# EAGLE design mpp_bldc_GAN (EAGLE 9.2.2)
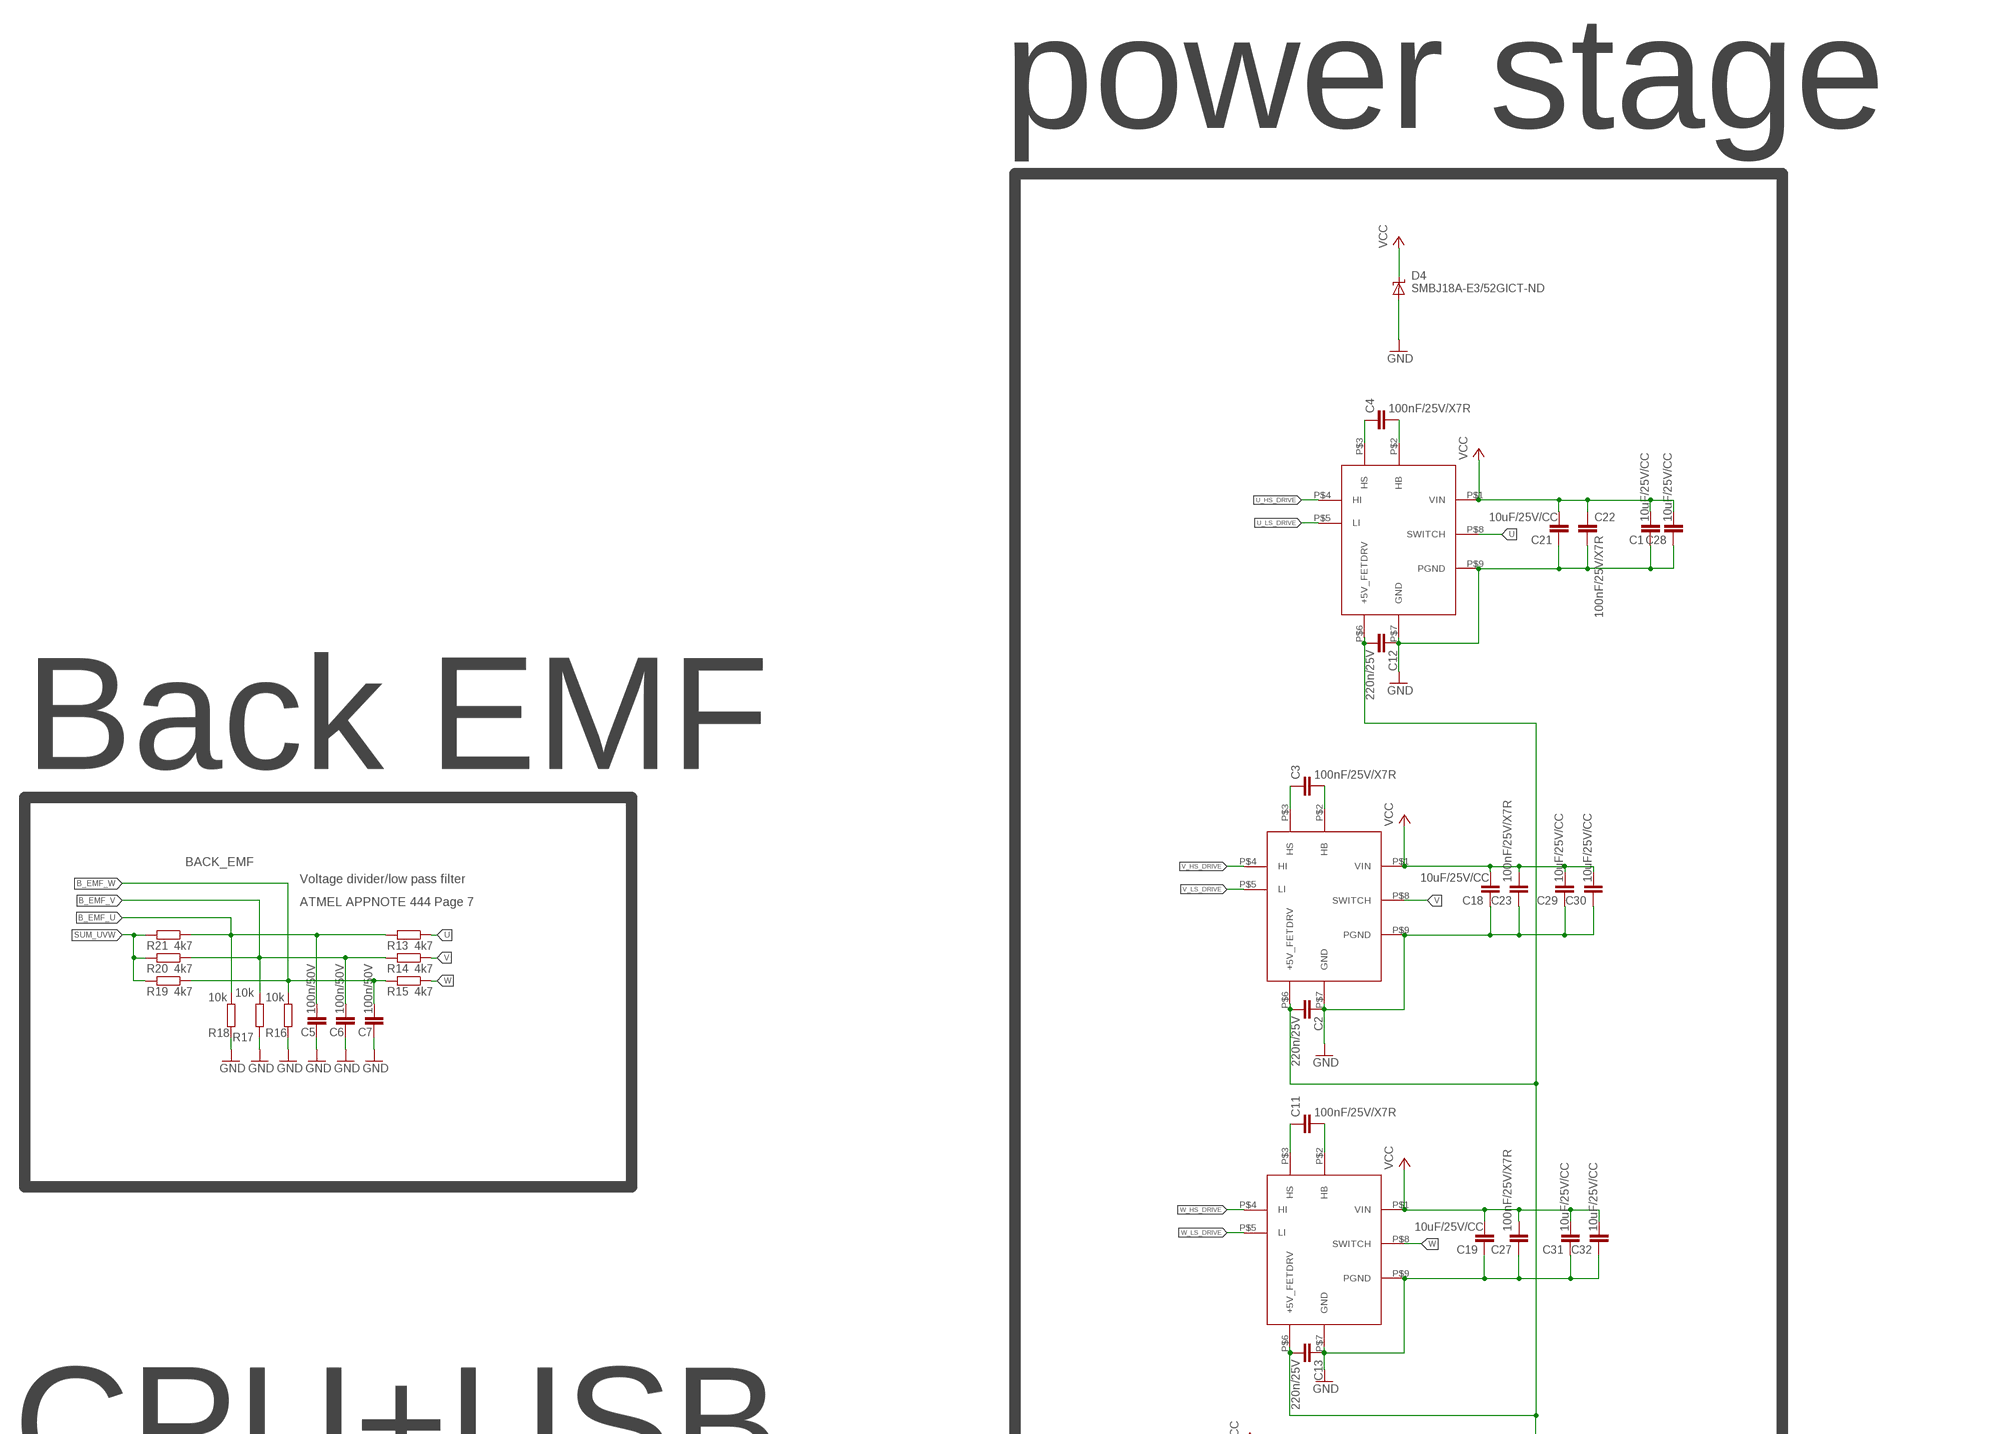
[diagram p0: schematic, sheet 1, part 1 of 2]
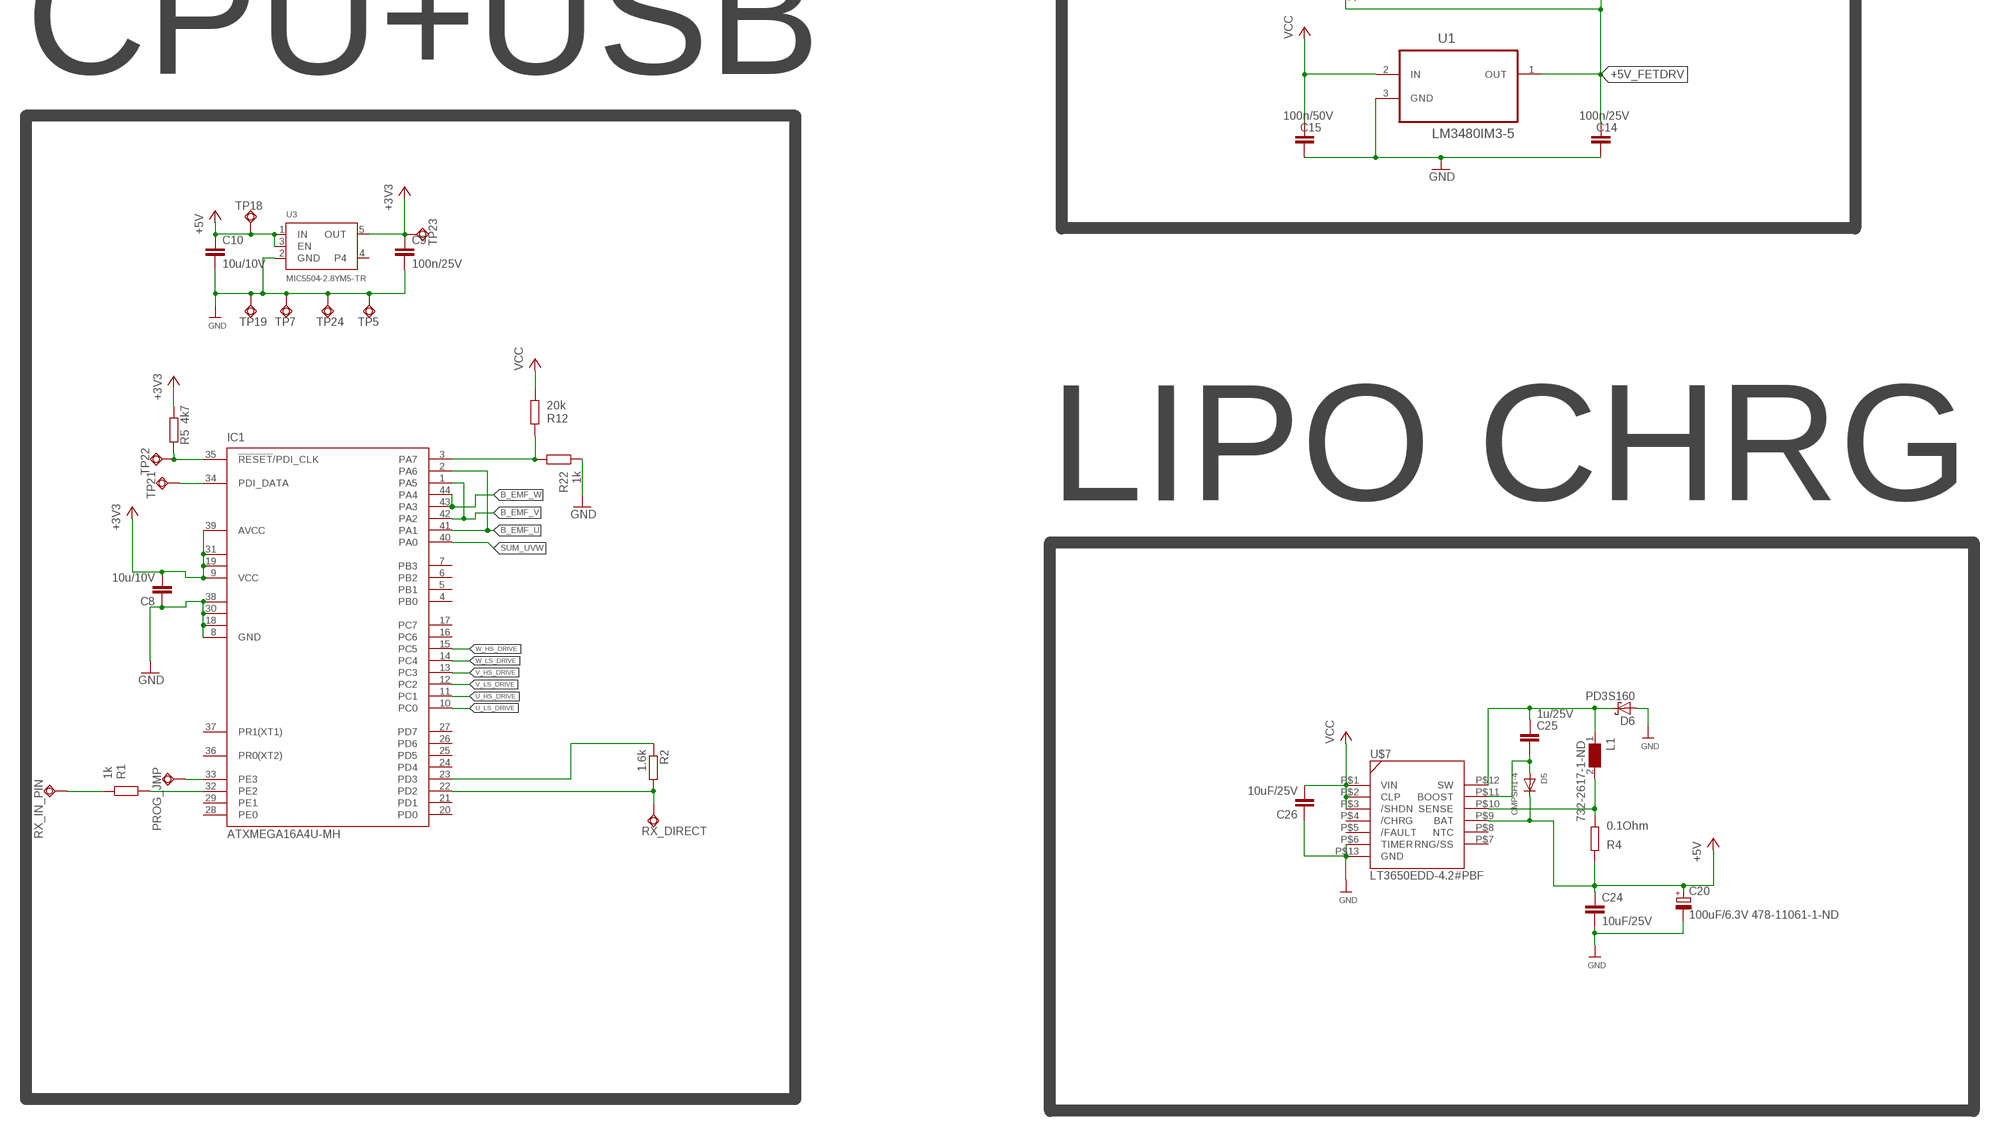
[diagram p1: schematic, sheet 1, part 2 of 2]

## Parts
C1  10uF/25V/CC  C-EUC1206  [C1206]
C2  220n/25V  C-EUC0402  [C0402]
C3  100nF/25V/X7R  C-EUC0402  [C0402]
C4  100nF/25V/X7R  C-EUC0402  [C0402]
C5  100n/50V  C-EUC0402  [C0402]
C6  100n/50V  C-EUC0402  [C0402]
C7  100n/50V  C-EUC0402  [C0402]
C8  10u/10V  C-EUC0603K  [C0603K]
C9  100n/25V  C-EUC0603  [C0603]
C10  10u/10V  C-EUC0603K  [C0603K]
C11  100nF/25V/X7R  C-EUC0402  [C0402]
C12  220n/25V  C-EUC0402  [C0402]
C13  220n/25V  C-EUC0402  [C0402]
C14  100n/25V  C-EUC0603  [C0603]
C15  100n/50V  C-EUC0603  [C0603]
C18  10uF/25V/CC  C-EUC1206  [C1206]
C19  10uF/25V/CC  C-EUC1206  [C1206]
C20  100uF/6.3V 478-11061-1-ND  CPOL-EUCT7343  [CT7343]
C21  10uF/25V/CC  C-EUC1206  [C1206]
C22  100nF/25V/X7R  C-EUC0402  [C0402]
C23  100nF/25V/X7R  C-EUC0402  [C0402]
C24  10uF/25V  C-EUC0805  [C0805]
C25  1u/25V  C-EUC0603  [C0603]
C26  10uF/25V  C-EUC0805  [C0805]
C27  100nF/25V/X7R  C-EUC0402  [C0402]
C28  10uF/25V/CC  C-EUC1206  [C1206]
C29  10uF/25V/CC  C-EUC1206  [C1206]
C30  10uF/25V/CC  C-EUC1206  [C1206]
C31  10uF/25V/CC  C-EUC1206  [C1206]
C32  10uF/25V/CC  C-EUC1206  [C1206]
D4  SMBJ18A-E3/52GICT-ND  SUPPRESSOR-SMBJ  [SMBJ]
D5  CMPSH1-4  DIODESOT23_REFLOW  [SOT23-R]
D6  PD3S160  [POWERDI323]
IC1  ATXMEGA16A4U-MH  XMEGA16A4M1  [MLF44-TH]
L1  732-2617-1-ND  WE-TPC-744025001_2828  [WE-TPC_2828]
PROG_JMP  TPSQTP19SQ  [TP19SQ]
R1  1k  R-EU_R0603  [R0603]
R2  1.6k  R-EU_R0402  [R0402]
R4  0.1Ohm  R-EU_R0402  [R0402]
R5  4k7  R-EU_R0603  [R0603]
R12  20k  R-EU_R0402  [R0402]
R13  4k7  R-EU_R0402  [R0402]
R14  4k7  R-EU_R0402  [R0402]
R15  4k7  R-EU_R0402  [R0402]
R16  10k  R-EU_R0402  [R0402]
R17  10k  R-EU_R0402  [R0402]
R18  10k  R-EU_R0402  [R0402]
R19  4k7  R-EU_R0402  [R0402]
R20  4k7  R-EU_R0402  [R0402]
R21  4k7  R-EU_R0402  [R0402]
R22  1k  R-EU_R0402  [R0402]
RX_DIRECT  TPSQTP11SQ  [TP11SQ]
RX_IN_PIN  TPSQTP19SQ  [TP19SQ]
TP5  TPSQTP19SQ  [TP19SQ]
TP7  TPSQTP10R  [TP10R]
TP18  TPSQTP19SQ  [TP19SQ]
TP19  TPSQTP19SQ  [TP19SQ]
TP21  TPSQTP15R  [TP15R]
TP22  TPSQTP14SQ  [TP14SQ]
TP23  TPSQTP14SQ  [TP14SQ]
TP24  TPSQTP14SQ  [TP14SQ]
U1  LM3480IM3-5  LM3480IM3-12  [SOT95P251X112-3N]
U3  MIC5504-2.8YM5-TR  VREG_SOT23-5  [SOT23-5]
U$1  LMG5200  [LMG5200]
U$2  LMG5200  [LMG5200]
U$3  LMG5200  [LMG5200]
U$7  LT3650EDD-4.2#PBF  LT3650-4.2  [12-WFDFN]

## Nets
+3V3: C8.2 C9.1 IC1.9(VCC) IC1.19(VCC1) IC1.31(VCC2) IC1.39(AVCC) R5.1 TP23.TP U3.5(OUT)
+5V: C10.1 C20.+ C24.1 D5.3(C) R4.2 TP18.TP U3.1(IN) U3.3(EN) U$7.P$9(BAT)
+5V_FETDRV: C2.2 C12.2 C13.2 C14.2 U1.1(OUT) U$1.P$6(+5V_FETDRV) U$2.P$6(+5V_FETDRV) U$3.P$6(+5V_FETDRV)
B_EMF_U: C5.1 IC1.2(PA6) IC1.41(PA1) R13.2 R18.1 R21.1
B_EMF_V: C6.1 IC1.1(PA5) IC1.42(PA2) R14.2 R17.1 R20.1
B_EMF_W: C7.1 IC1.43(PA3) IC1.44(PA4) R15.2 R16.1 R19.1
GND: C1.1 C2.1 C5.2 C6.2 C7.2 C8.1 C9.2 C10.2 C12.1 C13.1 C14.1 C15.1 C18.1 C19.1 C20.- C21.1 C22.2 C23.1 C24.2 C26.1 C27.1 C28.1 C29.1 C30.1 C31.1 C32.1 D4.A D6.A IC1.8(GND) IC1.18(GND1) IC1.30(GND2) IC1.38(GND3) R16.2 R17.2 R18.2 R22.1 TP5.TP TP7.TP TP19.TP TP24.TP U1.3(GND) U3.2(GND) U$1.P$7(GND) U$1.P$9(PGND) U$2.P$7(GND) U$2.P$9(PGND) U$3.P$7(GND) U$3.P$9(PGND) U$7.P$6(TIMER) U$7.P$13(GND)
N$2: IC1.3(PA7) R12.2 R22.2
N$3: C3.1 U$2.P$3(HS)
N$4: IC1.32(PE2) R1.2
N$6: C3.2 U$2.P$2(HB)
N$7: C4.1 U$3.P$3(HS)
N$8: C4.2 U$3.P$2(HB)
N$9: C11.1 U$1.P$3(HS)
N$10: C11.2 U$1.P$2(HB)
N$12: C25.1 D6.C L1.1 U$7.P$12(SW)
N$14: L1.2 R4.1 U$7.P$10(SENSE)
N$16: C25.2 D5.1(A) U$7.P$11(BOOST)
PDI_DATA: IC1.34(PDI_DATA) TP21.TP
PROG_JMP: IC1.33(PE3) PROG_JMP.TP
RC_SIG_RCV: R1.1 RX_IN_PIN.TP
RST_PDICLK: IC1.35(!RESET!/PDI_CLK) R5.2 TP22.TP
RX_DIRECT_PD2: IC1.22(PD2) R2.2 RX_DIRECT.TP
SUM_UVW: IC1.40(PA0) R19.2 R20.2 R21.2
TX_DIRECT_PD3: IC1.23(PD3) R2.1
U: R13.1 U$3.P$8(SWITCH)
U_HS_DRIVE: IC1.11(PC1) U$3.P$4(HI)
U_LS_DRIVE: IC1.10(PC0) U$3.P$5(LI)
V: R14.1 U$2.P$8(SWITCH)
V_HS_DRIVE: IC1.13(PC3) U$2.P$4(HI)
V_LS_DRIVE: IC1.12(PC2) U$2.P$5(LI)
VCC: C1.2 C15.2 C18.2 C19.2 C21.2 C22.1 C23.2 C26.2 C27.2 C28.2 C29.2 C30.2 C31.2 C32.2 D4.C R12.1 U1.2(IN) U$1.P$1(VIN) U$2.P$1(VIN) U$3.P$1(VIN) U$7.P$1(VIN) U$7.P$2(CLP) U$7.P$3(/SHDN)
W: R15.1 U$1.P$8(SWITCH)
W_HS_DRIVE: IC1.15(PC5) U$1.P$4(HI)
W_LS_DRIVE: IC1.14(PC4) U$1.P$5(LI)
Unconnected: IC1.4(PB0) IC1.5(PB1) IC1.6(PB2) IC1.7(PB3) IC1.16(PC6) IC1.17(PC7) IC1.20(PD0) IC1.21(PD1) IC1.24(PD4) IC1.25(PD5) IC1.26(PD6) IC1.27(PD7) IC1.28(PE0) IC1.29(PE1) IC1.36(PR0(XT2)) IC1.37(PR1(XT1)) U3.4 U$7.P$4(/CHRG) U$7.P$5(/FAULT) U$7.P$7(RNG/SS) U$7.P$8(NTC)

## Notes on the sheet
- power stage
- Back EMF
- BACK_EMF
- Voltage divider/low pass filter
- ATMEL APPNOTE 444 Page 7
- CPU+USB
- LIPO CHRG

## Library data of the parts
C1-C4 C11-C13 C18 C19 C21-C23 C27-C32 = rcl:C-EU: CAPACITOR, European symbol; SPICEPREFIX: C
C5-C10 C14 C15 C24-C26 = rcl:C-EU: CAPACITOR, European symbol
C20 = rcl:CPOL-EU: POLARIZED CAPACITOR, European symbol
D4 = diode:SUPPRESSOR-: Suppressor diode
D5 = adafruit:DIODE: Diode SMADIODE - SMA Surface Mount Package 20V 1A Schottky Diode Digikey: 641-1014-6-ND DO-1N4148 - Through Hole Small Current Diode SOD-123 20V 1 A (.5mV Vf) Schottky Diode - Digikey: MBRX120TPMSCT-ND SOD-323 10V 570mA (.38mV Vf, 3ns) Schottky Diode - Digikey: ZLLS410CT-ND SOD-523 30V 30mA Schottky Diode (RB751S-40TE61) - Digikey: RB751S-40TE61CT-ND SOT23-R/W - SOT23 Package (R = Solder Paste/Reflow Ovens, W = Hand-Soldering) BAT54Film 40V 300mA - Digikey: 497-7162-1-ND
D6 = diode:PD3S160: 1.0A SURFACE MOUNT SCHOTTKY BARRIER RECTIFIER POWERDI ® 323 Source: http://www.diodes.com/datasheets/ds30899.pdf
IC1 = atmel:XMEGA16A4: MICROCONTROLLER Features High-performance, Low-power 8/16-bit AVR XMEGA Microcontroller Non-Volatile Program and Data Memories - 16 KB - 128 KB of In-System Self-Programmable Flash - 4 KB - 8 KB Boot Code Section with Independent Lock Bits - 1 KB - 2 KB EEPROM - 2 KB - 8 KB Internal SRAM Peripheral Features - Four-channel DMA Controller with support for external requests - Eight-channel Event System - Five 16-bit Timer/Counters Three Timer/Counters with 4 Output Compare or Input Capture channels Two Timer/Counters with 2 Output Compare or Input Capture channels High-Resolution Extensions on all Timer/Counters Advanced Waveform Extension on one Timer/Counter - Five USARTs IrDA Extension on one USART - Two Two-Wire Interfaces with dual address match (I2C and SMBus compatible) - Two SPIs (Serial Peripheral Interfaces) peripherals - AES and DES Crypto Engine - 16-bit Real Time Counter with Separate Oscillator - One Twelve-channel, 12-bit, 2 Msps Analog to Digital Converter - One Two-channel, 12-bit, 1 Msps Digital to Analog Converter - Two Analog Comparators with Window compare function - External Interrupts on all General Purpose I/O pins - Programmable Watchdog Timer with Separate On-chip Ultra Low Power Oscillator Special Microcontroller Features - Power-on Reset and Programmable Brown-out Detection - Internal and External Clock Options with PLL - Programmable Multi-level Interrupt Controller - Sleep Modes: Idle, Power-down, Standby, Power-save, Extended Standby - Advanced Programming, Test and Debugging Interfaces PDI (Program and Debug Interface) for programming, test and debugging I/O and Packages - 34 Programmable I/O Lines - 44 - lead TQFP - 44 - pad VQFN/QFN - 49 - ball VFBGA Operating Voltage - 1.6 - 3.6V Speed performance - 0 - 12 MHz @ 1.6 - 3.6V - 0 - 32 MHz @ 2.7 - 3.6V Drawn by Dipl.-Ing. (FH) Robert Siegler Created: 27.05.09; OC_FARNELL: unknown; OC_NEWARK: unknown
L1 = WE-TPC:WE-TPC: Shielded Tiny Power Inductor WE-TPC - Extremely flat power inductor - High current capability - High reliability and perfect soldering characteristics because of integrated soldering pad - magnetically shielded -- Portable power like PDA, digital camera, PCMICA-cards and displays -- DC/DC-converter -- Recommended for switching regulator IC's from Linear Technology, National Semiconductor, Texas Instruments and Fairchild Semiconductor; MPN: 744025001; OC_FARNELL: 1869740; OC_NEWARK: 32T8552; PACKAGE: 2828; SUPPLIER: WURTH ELEKTRONIK
PROG_JMP RX_DIRECT RX_IN_PIN TP5 TP7 TP18 TP19 TP21-TP24 = testpad:TPSQ: Test pad
R1 R4 R5 R12-R22 = rcl:R-EU_: RESISTOR, European symbol
R2 = resistor:R-EU_: RESISTOR, European symbol
U1 = linear:LM3480IM3-12: Low-Dropout Linear Voltage; MPN: LM3480IM3-12; OC_FARNELL: 1469099; OC_NEWARK: -; PACKAGE: SOT-3; SUPPLIER: National Semiconductor
U3 = microbuilder:VREG_SOT23-5: SOT23-5 Fixed Voltage Regulators To better organise some of the SOT23-5 fixed voltage regulators in this library, this new part was created. Part Current Out V Out V In V Dropout Digikey Part No. ADP121 150mA 3.3V 3.4-5.5V 0.09V @ 150mA ADP121-AUJZ33R7CT-ND ADP121 150mA 3.0V 3.1-5.5V 0.09V @ 150mA ADP121-AUJZ30R7CT-ND ADP122 300mA 3.3V 3.4-5.5V 0.085V @ 300mA ADP122AUJZ-3.3-R7CT-ND ADP1712 300mA 3.3V 3.5-5.5V 0.17V @ 300mA ADP1712AUJZ-3.3-R7TR-ND AP7311 (Low Cost) 150mA 3.3V 3.5-6V 0.15V @ 150mA AP7311-33WG-7DICT-ND LD39015M18R 150mA 1.8V 1.9V-5.5V 0.08V @ 100mA 497-6977-1-ND MCP1824T-3302E/OT 300mA 3.3V 3.5V-6V 0.2V @ 300mA MCP1824T-3302E/OTCT-ND MIC5205-2.5YM5 TR 150mA 2.5V 2.7-16V 0.165V @ 150mA 576-1257-2-ND MIC5205-3.0YM5 TR 150mA 3.0V 3.2V-16V 0.165V @ 150mA 576-1258-2-ND MIC5205-3.3YM5 TR 150mA 3.3V 3.5V-16V 0.165V @ 150mA 576-1259-2-ND TPS780330220 150mA 3.3V+2.2V 3.6-5.5V 250mV Max 296-23332-1-ND TDA3663/N1,135 100mA 3.3V 3.5-45V 0.18V @ 50mA 568-5343-1-ND
U$1-U$3 = lmg5200:LMG5200
U$7 = mpp_bldc_ng_2:LT3650-4.2

## Board
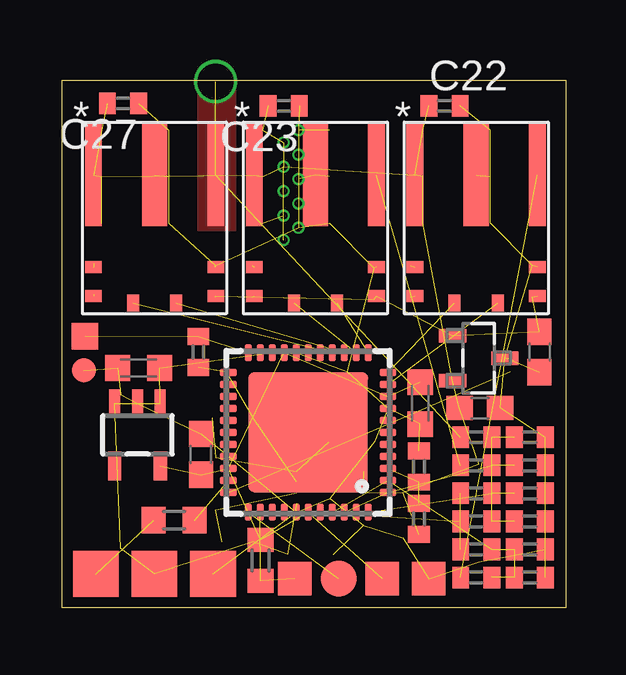
[diagram p2: board, top side]
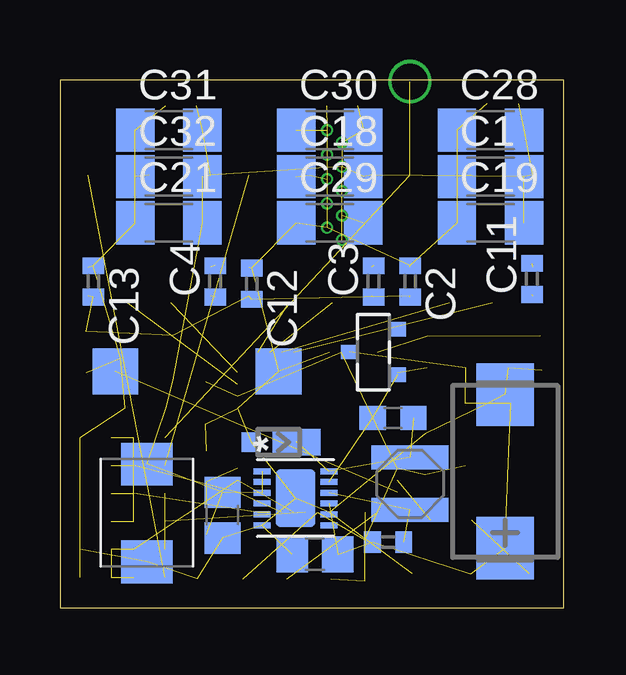
[diagram p3: board, bottom side, seen from below]

Size 21 x 22 mm. Coordinates in mm from the lower left corner, seen from the top.
Outline: 0,0 0,22 21,22 21,0 0,0
Copper layers ([2:1+(2*(3+14)*15)+16:15]): Top 0.035mm / dielectric 0.35mm / Route3 0.035mm / dielectric 0.76mm / Route3 0.035mm / dielectric 0.2mm / Route14 0.035mm / dielectric 0.15mm / Route14 0.035mm / dielectric 0.35mm / Bottom 0.035mm
Design rules "we-dru-4-layer *": minimum track width 0.1mm, minimum drill 0.2mm, track to track 0.1mm, track to pad 0.1mm, pad to pad 0.1mm, via to via 0.1mm, smd to smd 0mil, copper to edge 0.4mm, drill to drill 0.2mm, minimum pad ring 0.18mm, minimum via ring 0.1mm, stop-mask expansion 0.1mm, vias tented up to drill 0.5mm, thermal gap 0.25mm

### Footprints (pad centres in the part's own frame; a part is rotated, then mirrored left to right if it is on the bottom)
C1206 = smd 1.6 x 1.8: 1 -1.4,0; 2 1.4,0
C0402 = smd 0.7 x 0.9: 1 -0.65,0; 2 0.65,0
C0603K = smd 1.05 x 1.08: 1 -0.875,0; 2 0.875,0
C0603 = smd 1.1 x 1: 1 -0.85,0; 2 0.85,0
CT7343 = smd 2.6 x 2.4: + -3.2,0; - 3.2,0
C0805 = smd 1.3 x 1.5: 1 -0.95,0; 2 0.95,0
SMBJ = smd 1.78 x 2.16: A 2.04,0; C -2.03,0
SOT23-R = smd 0.6 x 0.7: 1 -0.95,-1; 2 0.95,-1; 3 0,1
POWERDI323 = smd 0.8 x 0.8: A 1.15,0 | smd 2 x 1.1: C -0.75,0
MLF44-TH = smd 0.7 x 0.3: 1 -3.325,2.5; 2 -3.325,2; 3 -3.325,1.5; 4 -3.325,1; 5 -3.325,0.5; 6 -3.325,0; 7 -3.325,-0.5; 8 -3.325,-1; 9 -3.325,-1.5; 10 -3.325,-2; 11 -3.325,-2.5; 23 3.325,-2.5; 24 3.325,-2; 25 3.325,-1.5; 26 3.325,-1; 27 3.325,-0.5; 28 3.325,0; 29 3.325,0.5; 30 3.325,1; 31 3.325,1.5; 32 3.325,2; 33 3.325,2.5 | smd 0.3 x 0.7: 12 -2.5,-3.325; 13 -2,-3.325; 14 -1.5,-3.325; 15 -1,-3.325; 16 -0.5,-3.325; 17 0,-3.325; 18 0.5,-3.325; 19 1,-3.325; 20 1.5,-3.325; 21 2,-3.325; 22 2.5,-3.325; 34 2.5,3.325; 35 2,3.325; 36 1.5,3.325; 37 1,3.325; 38 0.5,3.325; 39 0,3.325; 40 -0.5,3.325; 41 -1,3.325; 42 -1.5,3.325; 43 -2,3.325; 44 -2.5,3.325 | smd 5 x 5: TH 0,0
WE-TPC_2828 = smd 3.2 x 1: 1 0,1.1; 2 0,-1.1
TP19SQ = smd 1.9 x 1.9: TP 0,0
R0603 = smd 1 x 1.1: 1 -0.85,0; 2 0.85,0
R0402 = smd 0.7 x 0.9: 1 -0.65,0; 2 0.65,0
TP11SQ = smd 1.1 x 1.1: TP 0,0
TP10R = smd 1 x 1: TP 0,0
TP15R = smd 1.5 x 1.5: TP 0,0
TP14SQ = smd 1.4 x 1.4: TP 0,0
SOT95P251X112-3N = smd 0.559 x 1.143: 1 -0.94,-1.092; 2 0.94,-1.092; 3 0,1.092
SOT23-5 = smd 0.457 x 1.2: 1 -0.95,-1.3; 2 0,-1.3; 3 0.95,-1.3 | smd 0.55 x 1.2: 4 0.95,1.3; 5 -0.95,1.3
LMG5200 = smd 0.7 x 4.25: P$1 -2.55,1.78; P$8 2.55,1.78 | smd 0.7 x 0.5: P$2 -2.55,-2.05; P$3 -2.55,-3.25; P$6 2.55,-3.25; P$7 2.55,-2.05 | smd 0.5 x 0.7: P$4 -0.9,-3.55; P$5 0.9,-3.55 | smd 1.05 x 4.25: P$9 0,1.78
12-WFDFN = smd 0.25 x 0.7: P$1 -1.125,-1.4; P$2 -0.675,-1.4; P$3 -0.225,-1.4; P$4 0.225,-1.4; P$5 0.675,-1.4; P$6 1.125,-1.4; P$7 1.125,1.4; P$8 0.675,1.4; P$9 0.225,1.4; P$10 -0.225,1.4; P$11 -0.675,1.4; P$12 -1.125,1.4 | smd 2.38 x 1.65: P$13 0,0

### Placement (x,y rotation side)
C1  3.05,17.98 0 bottom
C2  6.4,13.61 270 bottom
C3  7.92,13.61 90 bottom
C4  14.53,13.61 90 bottom
C5  19.51,1.27 0 top
C6  19.51,3.61 0 top
C7  19.51,4.78 0 top
C8  14.94,8.53 90 top
C9  5.79,6.4 90 top
C10  3.2,10.01 180 top
C11  1.32,13.72 90 bottom
C12  13,13.51 270 bottom
C13  19.61,13.61 270 bottom
C14  19.91,10.67 90 top
C15  17.42,8.33 180 top
C18  9.75,17.98 0 bottom
C19  3.05,16.05 0 bottom
C20  2.44,5.69 90 bottom
C21  16.46,16.05 0 bottom
C22  15.95,20.93 0 top
C23  9.25,20.93 180 top
C24  10.36,2.24 180 bottom
C25  7.11,7.92 180 bottom
C26  14.22,3.86 90 bottom
C27  2.54,21.03 180 top
C28  3.05,19.91 0 bottom
C29  9.75,16.05 0 bottom
C30  9.75,19.91 0 bottom
C31  16.46,19.91 0 bottom
C32  16.46,17.98 0 bottom
D4  17.37,3.96 270 bottom
D5  7.92,10.67 90 bottom
D6  11.89,6.91 180 bottom
IC1  10.26,7.32 180 top
L1  6.4,5.18 0 bottom
PROG_JMP  18.69,9.86 90 bottom
R1  4.67,3.66 0 top
R2  5.69,10.67 90 top
R4  7.32,2.74 180 bottom
R5  8.28,1.98 270 top
R12  14.88,3.71 90 top
R13  17.27,1.27 0 top
R14  17.27,5.94 0 top
R15  17.27,7.11 0 top
R16  19.51,7.11 0 top
R17  19.51,5.94 0 top
R18  19.51,2.44 0 top
R19  17.27,4.78 180 top
R20  17.27,3.61 180 top
R21  17.27,2.44 180 top
R22  14.88,5.89 270 top
RX_DIRECT  0.96,11.33 270 top
RX_IN_PIN  1.42,1.42 270 top
TP5  11.89,9.86 270 bottom
TP7  0.91,9.91 270 top
TP18  3.86,1.42 90 top
TP19  6.3,1.42 90 top
TP21  11.53,1.22 180 top
TP22  9.7,1.22 180 top
TP23  13.36,1.22 180 top
TP24  15.29,1.22 180 top
U1  17.37,10.41 270 top
U3  3.15,7.21 180 top
U$1  3.86,16.26 0 top
U$2  10.57,16.26 0 top
U$3  17.27,16.26 0 top
U$7  11.18,4.57 270 bottom

### Tracks (layer width: path | path; a pad name or v marks a point on that pad's centre or on a via)
+3V3  (8 unrouted)
+5V  (8 unrouted)
+5V_FETDRV  (7 unrouted)
B_EMF_U  (5 unrouted)
B_EMF_V  (5 unrouted)
B_EMF_W  (5 unrouted)
GND  (via drill 0.3)  (54 unrouted)
  other vias: 9.86,19.91 9.86,18.9 9.86,17.88 9.86,16.87 9.86,15.85
N$2  (2 unrouted)
N$3  (1 unrouted)
N$4  (1 unrouted)
N$6  (1 unrouted)
N$7  (1 unrouted)
N$8  (1 unrouted)
N$9  (1 unrouted)
N$10  (1 unrouted)
N$12  (3 unrouted)
N$14  (2 unrouted)
N$16  (2 unrouted)
PDI_DATA  (1 unrouted)
PROG_JMP  (1 unrouted)
RC_SIG_RCV  (1 unrouted)
RST_PDICLK  (2 unrouted)
RX_DIRECT_PD2  (2 unrouted)
SUM_UVW  (3 unrouted)
TX_DIRECT_PD3  (1 unrouted)
U  (1 unrouted)
U_HS_DRIVE  (1 unrouted)
U_LS_DRIVE  (1 unrouted)
V  (1 unrouted)
V_HS_DRIVE  (1 unrouted)
V_LS_DRIVE  (1 unrouted)
VCC  (via drill 0.3)  (27 unrouted)
  other vias: 9.25,19.41 9.25,18.39 9.25,17.37 9.25,16.36 9.25,15.34
W  (via drill 1.5)  (2 unrouted)
  other vias: 6.4,21.95
  pour Top (no thermals): 5.69,15.75 7.21,15.75 7.21,21.84 5.69,21.84
W_HS_DRIVE  (1 unrouted)
W_LS_DRIVE  (1 unrouted)